# Altium project UZ_D_Testboard.PrjPcb
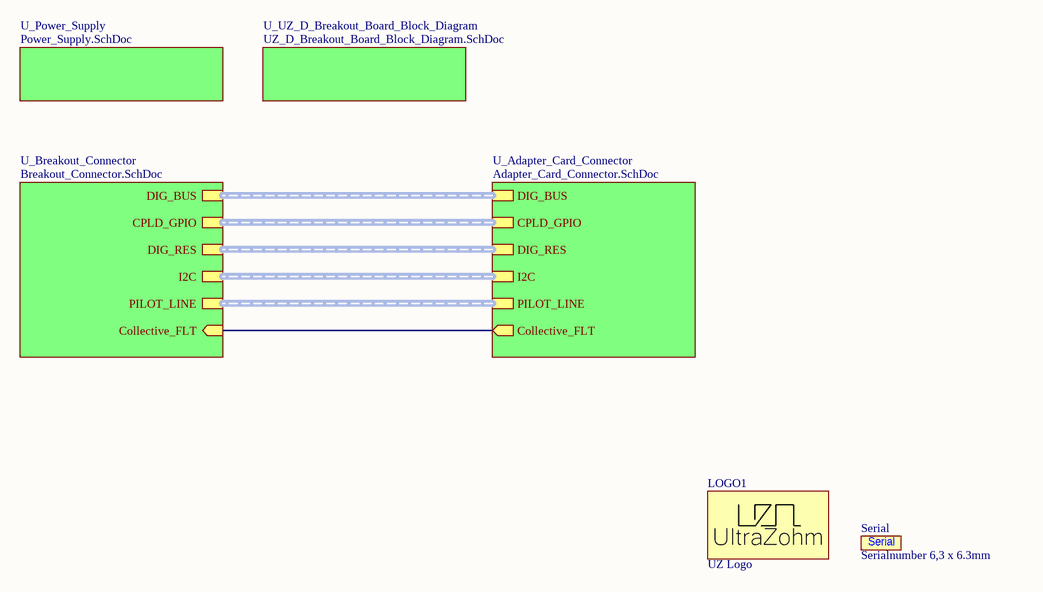
[diagram p0: Topsheet.SchDoc]
AuthorParam: Andreas Geiger; ProjectDate: 04/2021; ProjectRevision: Rev01
5 sheets, 51 parts. Net scope: hierarchical (ports join the sheet entries above them; power ports are global).
Board file: UZ_D_Testboard.PcbDoc
Sheets:
  Topsheet.SchDoc
    U_Adapter_Card_Connector = Adapter_Card_Connector.SchDoc
    U_Breakout_Connector = Breakout_Connector.SchDoc
    U_Power_Supply = Power_Supply.SchDoc
    U_UZ_D_Breakout_Board_Block_Diagram = UZ_D_Breakout_Board_Block_Diagram.SchDoc

## Sheet Topsheet.SchDoc
size A4; PageSetup: Record=PageOptions|CenterHorizontal=True|CenterVertical=True|PrintScale=0.92|XCorrection=1.00|YCorrection=1.00|PrintKind=0|BorderSize=5000000|LeftOffset=0|BottomOffset=0|Orientation=2|PaperLength=1000|PaperWidth=1000|Scale=100|PaperSource=7|PrintQuality=-4|MediaType=1|DitherType=10|PrintScaleMode=1|PaperKind=A4; Author: Andreas Geiger; CompanyName: Technische Hochschule Nürnberg Georg Simon Ohm; Organization: UltraZohm; Address1: Kesslerplatz 12; Address2: 90489 Nürnberg; Address3: GERMANY; DocumentNumber: 5; SheetNumber: 5; SheetTotal: 5; Website: www.ultrazohm.com

### Parts
LOGO1  UZ Logo  [UZ_Logo_small]  (no BOM)
Serial  Serialnumber 6,3 x 6.3mm  [Serial_6.3x6.3mm]  (no BOM)

### Sub-sheets
U_Adapter_Card_Connector = Adapter_Card_Connector.SchDoc: DIG_BUS (harness DIG_BUS), CPLD_GPIO (harness CPLD_GPIO), DIG_RES (harness DIG_RES), I2C (harness I2C), PILOT_LINE (harness PILOT_LINE), Collective_FLT (out)
U_Breakout_Connector = Breakout_Connector.SchDoc: DIG_BUS (harness DIG_BUS), CPLD_GPIO (harness CPLD_GPIO), DIG_RES (harness DIG_RES), I2C (harness I2C), PILOT_LINE (harness PILOT_LINE), Collective_FLT (in)
U_Power_Supply = Power_Supply.SchDoc: no entries
U_UZ_D_Breakout_Board_Block_Diagram = UZ_D_Breakout_Board_Block_Diagram.SchDoc: no entries

### Nets
Collective_FLT: sheet U_Adapter_Card_Connector/Collective_FLT, sheet U_Breakout_Connector/Collective_FLT

### Buses and harness runs
harness sheet U_Adapter_Card_Connector/CPLD_GPIO = sheet U_Breakout_Connector/CPLD_GPIO
harness sheet U_Adapter_Card_Connector/DIG_BUS = sheet U_Breakout_Connector/DIG_BUS
harness sheet U_Adapter_Card_Connector/DIG_RES = sheet U_Breakout_Connector/DIG_RES
harness sheet U_Adapter_Card_Connector/I2C = sheet U_Breakout_Connector/I2C
harness sheet U_Adapter_Card_Connector/PILOT_LINE = sheet U_Breakout_Connector/PILOT_LINE

### Notes on the sheet
- Title
- Revision:
- Design Engineer:
- Date:
- Project:
- Sheet
- of

### Library data of the parts
LOGO1 = UZ Logo: UltraZohm Logo on PCB; Created: Jan2021_Liegmann; Value: UZ Logo
Serial = SerialNumber: Created: 2018_09_18_AGeiger; Value: Serialnumber 6,3 x 6.3mm

## Sheet Adapter_Card_Connector.SchDoc
size A4; PageSetup: Record=PageOptions|CenterHorizontal=True|CenterVertical=True|PrintScale=0.92|XCorrection=1.00|YCorrection=1.00|PrintKind=0|BorderSize=5000000|LeftOffset=0|BottomOffset=0|Orientation=2|PaperLength=1000|PaperWidth=1000|Scale=100|PaperSource=7|PrintQuality=-4|MediaType=1|DitherType=10|PrintScaleMode=1|PaperKind=A4; Author: Andreas Geiger; CompanyName: Technische Hochschule Nürnberg Georg Simon Ohm; Organization: UltraZohm; Address1: Kesslerplatz 12; Address2: 90489 Nürnberg; Address3: GERMANY; DocumentNumber: 2; SheetNumber: 2; SheetTotal: 5; Website: www.ultrazohm.com
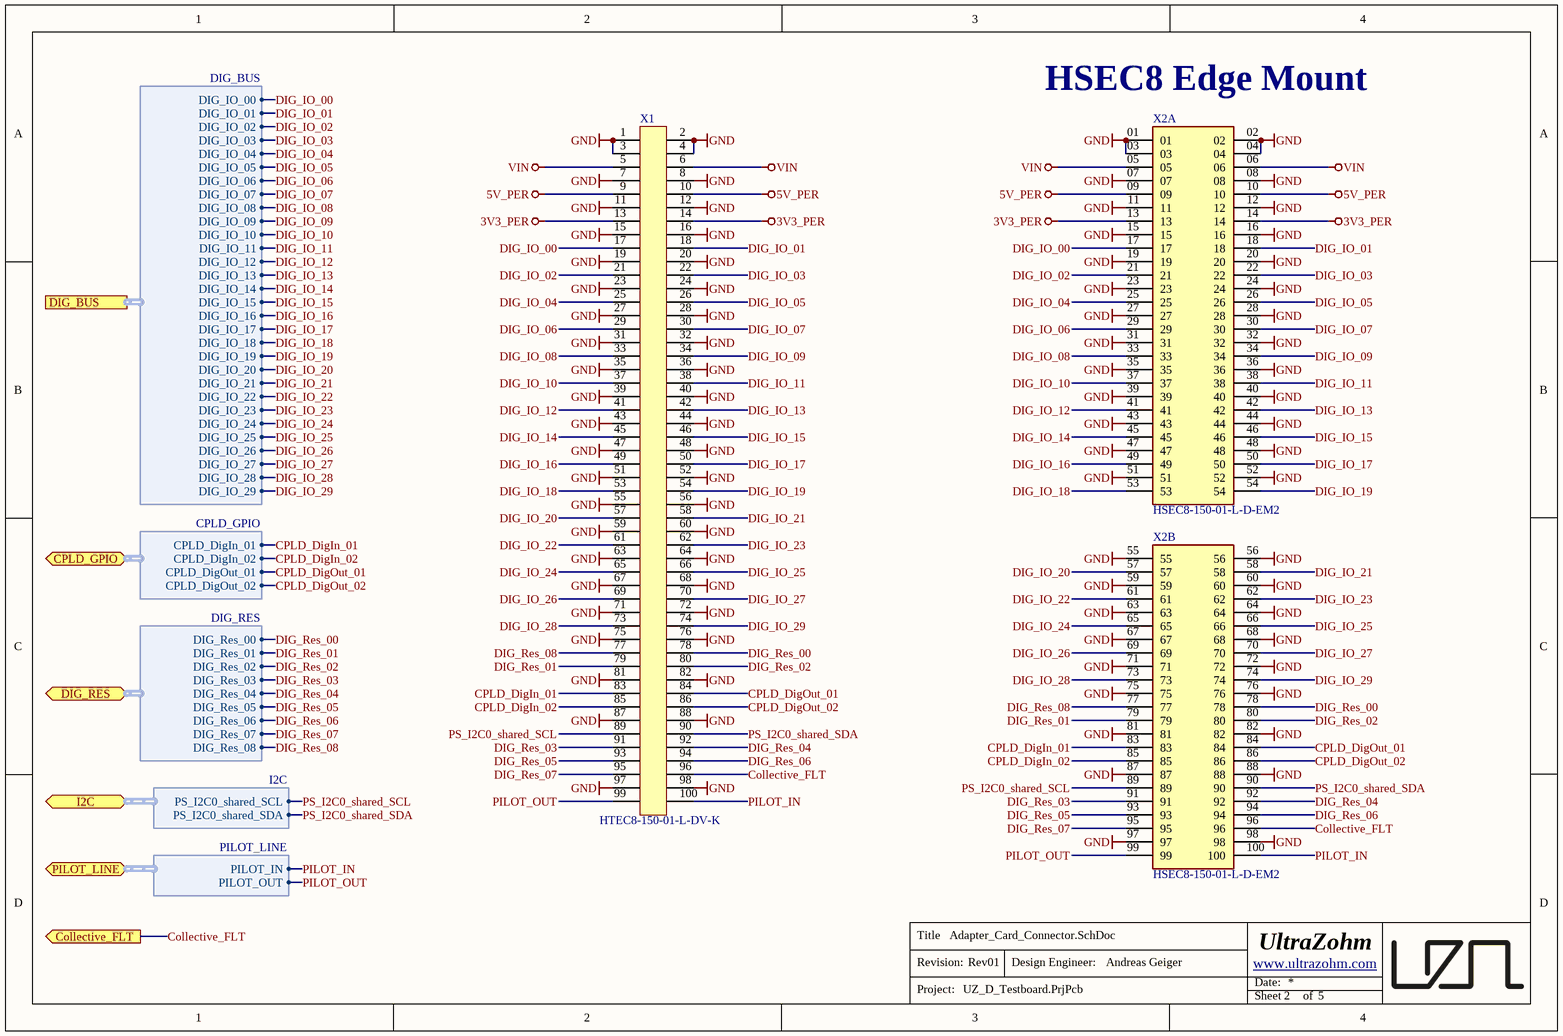
[diagram p1: Adapter_Card_Connector.SchDoc]

### Parts
X1  HTEC8-150-01-L-DV-K  [HTEC8-150-XX-X-DV]
X2  HSEC8-150-01-L-D-EM2  [HSEC8-150-01-L-D-EM2]  (parts A,B of 2)

### Ports
Collective_FLT (out), CPLD_GPIO (bidir, harness CPLD_GPIO), DIG_BUS (harness DIG_BUS), DIG_RES (bidir, harness DIG_RES), I2C (bidir, harness I2C), PILOT_LINE (bidir, harness PILOT_LINE)

### Harnesses
DIG_BUS: DIG_IO_01, DIG_IO_02, DIG_IO_03, DIG_IO_04, DIG_IO_05, DIG_IO_06, DIG_IO_07, DIG_IO_08, DIG_IO_09, DIG_IO_10, DIG_IO_11, DIG_IO_12, DIG_IO_13, DIG_IO_14, DIG_IO_15, DIG_IO_16, DIG_IO_17, DIG_IO_18, DIG_IO_19, DIG_IO_20, DIG_IO_21, DIG_IO_22, DIG_IO_23, DIG_IO_24, DIG_IO_25, DIG_IO_26, DIG_IO_27, DIG_IO_28, DIG_IO_29, DIG_IO_00
CPLD_GPIO: CPLD_DigIn_01, CPLD_DigOut_01, CPLD_DigIn_02, CPLD_DigOut_02
DIG_RES: DIG_Res_00, DIG_Res_08, DIG_Res_01, DIG_Res_02, DIG_Res_03, DIG_Res_04, DIG_Res_05, DIG_Res_06, DIG_Res_07
I2C: PS_I2C0_shared_SDA, PS_I2C0_shared_SCL
PILOT_LINE: PILOT_OUT, PILOT_IN

### Nets
3V3_PER: X1.13 X1.14 X2.13 X2.14
5V_PER: X1.9 X1.10 X2.09 X2.10
GND: X1.1 X1.2 X1.3 X1.4 X1.7 X1.8 X1.11 X1.12 X1.15 X1.16 X1.19 X1.20 X1.23 X1.24 X1.27 X1.28 X1.31 X1.32 X1.35 X1.36 X1.39 X1.40 X1.43 X1.44 X1.47 X1.48 X1.51 X1.52 X1.55 X1.56 X1.59 X1.60 X1.63 X1.64 X1.67 X1.68 X1.71 X1.72 X1.75 X1.76 X1.81 X1.82 X1.87 X1.88 X1.97 X1.98 X2.01 X2.02 X2.03 X2.04 X2.07 X2.08 X2.11 X2.12 X2.15 X2.16 X2.19 X2.20 X2.23 X2.24 X2.27 X2.28 X2.31 X2.32 X2.35 X2.36 X2.39 X2.40 X2.43 X2.44 X2.47 X2.48 X2.51 X2.52 X2.55 X2.56 X2.59 X2.60 X2.63 X2.64 X2.67 X2.68 X2.71 X2.72 X2.75 X2.76 X2.81 X2.82 X2.87 X2.88 X2.97 X2.98
VIN: X1.5 X1.6 X2.05 X2.06
Collective_FLT: X1.96 X2.96 ; port Collective_FLT
CPLD_DigIn_01: X1.83 X2.83 ; port CPLD_GPIO.CPLD_DigIn_01
CPLD_DigIn_02: X1.85 X2.85 ; port CPLD_GPIO.CPLD_DigIn_02
CPLD_DigOut_01: X1.84 X2.84 ; port CPLD_GPIO.CPLD_DigOut_01
CPLD_DigOut_02: X1.86 X2.86 ; port CPLD_GPIO.CPLD_DigOut_02
DIG_IO_00: X1.17 X2.17 ; port DIG_BUS.DIG_IO_00
DIG_IO_01: X1.18 X2.18 ; port DIG_BUS.DIG_IO_01
DIG_IO_02: X1.21 X2.21 ; port DIG_BUS.DIG_IO_02
DIG_IO_03: X1.22 X2.22 ; port DIG_BUS.DIG_IO_03
DIG_IO_04: X1.25 X2.25 ; port DIG_BUS.DIG_IO_04
DIG_IO_05: X1.26 X2.26 ; port DIG_BUS.DIG_IO_05
DIG_IO_06: X1.29 X2.29 ; port DIG_BUS.DIG_IO_06
DIG_IO_07: X1.30 X2.30 ; port DIG_BUS.DIG_IO_07
DIG_IO_08: X1.33 X2.33 ; port DIG_BUS.DIG_IO_08
DIG_IO_09: X1.34 X2.34 ; port DIG_BUS.DIG_IO_09
DIG_IO_10: X1.37 X2.37 ; port DIG_BUS.DIG_IO_10
DIG_IO_11: X1.38 X2.38 ; port DIG_BUS.DIG_IO_11
DIG_IO_12: X1.41 X2.41 ; port DIG_BUS.DIG_IO_12
DIG_IO_13: X1.42 X2.42 ; port DIG_BUS.DIG_IO_13
DIG_IO_14: X1.45 X2.45 ; port DIG_BUS.DIG_IO_14
DIG_IO_15: X1.46 X2.46 ; port DIG_BUS.DIG_IO_15
DIG_IO_16: X1.49 X2.49 ; port DIG_BUS.DIG_IO_16
DIG_IO_17: X1.50 X2.50 ; port DIG_BUS.DIG_IO_17
DIG_IO_18: X1.53 X2.53 ; port DIG_BUS.DIG_IO_18
DIG_IO_19: X1.54 X2.54 ; port DIG_BUS.DIG_IO_19
DIG_IO_20: X1.57 X2.57 ; port DIG_BUS.DIG_IO_20
DIG_IO_21: X1.58 X2.58 ; port DIG_BUS.DIG_IO_21
DIG_IO_22: X1.61 X2.61 ; port DIG_BUS.DIG_IO_22
DIG_IO_23: X1.62 X2.62 ; port DIG_BUS.DIG_IO_23
DIG_IO_24: X1.65 X2.65 ; port DIG_BUS.DIG_IO_24
DIG_IO_25: X1.66 X2.66 ; port DIG_BUS.DIG_IO_25
DIG_IO_26: X1.69 X2.69 ; port DIG_BUS.DIG_IO_26
DIG_IO_27: X1.70 X2.70 ; port DIG_BUS.DIG_IO_27
DIG_IO_28: X1.73 X2.73 ; port DIG_BUS.DIG_IO_28
DIG_IO_29: X1.74 X2.74 ; port DIG_BUS.DIG_IO_29
DIG_Res_00: X1.78 X2.78 ; port DIG_RES.DIG_Res_00
DIG_Res_01: X1.79 X2.79 ; port DIG_RES.DIG_Res_01
DIG_Res_02: X1.80 X2.80 ; port DIG_RES.DIG_Res_02
DIG_Res_03: X1.91 X2.91 ; port DIG_RES.DIG_Res_03
DIG_Res_04: X1.92 X2.92 ; port DIG_RES.DIG_Res_04
DIG_Res_05: X1.93 X2.93 ; port DIG_RES.DIG_Res_05
DIG_Res_06: X1.94 X2.94 ; port DIG_RES.DIG_Res_06
DIG_Res_07: X1.95 X2.95 ; port DIG_RES.DIG_Res_07
DIG_Res_08: X1.77 X2.77 ; port DIG_RES.DIG_Res_08
PILOT_IN: X1.100 X2.100 ; port PILOT_LINE.PILOT_IN
PILOT_OUT: X1.99 X2.99 ; port PILOT_LINE.PILOT_OUT
PS_I2C0_shared_SCL: X1.89 X2.89 ; port I2C.PS_I2C0_shared_SCL
PS_I2C0_shared_SDA: X1.90 X2.90 ; port I2C.PS_I2C0_shared_SDA

### Notes on the sheet
- (near X2) HSEC8 Edge Mount
- Title
- Revision:
- Design Engineer:
- Date:
- Project:
- Sheet
- of

### Library data of the parts
X1 = 30757: AN: 30757; Mixed: SMT; Temperature-Range: -55/+125; Extra: Samtec 0.80 mm High-Speed Edge Card Connector, 100pin 10µ Plating; Case: HTEC8; HelpURL: b:\AD\adlib\datasheet\Samtec\HTEC8\; H-ART: HTEC8-150-01-L-DV-K
X2 = HSEC8-150-01-L-D-EM2: 100 Position Female Connector Non Specified - Dual Edge Gold 0.031" (0.80mm) Black; MF: Samtec; Value: HSEC8-150-01-L-D-EM2; MPN: HSEC8-150-01-L-D-EM2; Created: 2021_03_24_AGeiger

## Sheet Breakout_Connector.SchDoc
size A4; PageSetup: Record=PageOptions|CenterHorizontal=True|CenterVertical=True|PrintScale=0.92|XCorrection=1.00|YCorrection=1.00|PrintKind=0|BorderSize=5000000|LeftOffset=0|BottomOffset=0|Orientation=2|PaperLength=1000|PaperWidth=1000|Scale=100|PaperSource=7|PrintQuality=-4|MediaType=1|DitherType=10|PrintScaleMode=1|PaperKind=A4; Author: Andreas Geiger; CompanyName: Technische Hochschule Nürnberg Georg Simon Ohm; Organization: UltraZohm; Address1: Kesslerplatz 12; Address2: 90489 Nürnberg; Address3: GERMANY; DocumentNumber: 3; SheetNumber: 3; SheetTotal: 5; Website: www.ultrazohm.com
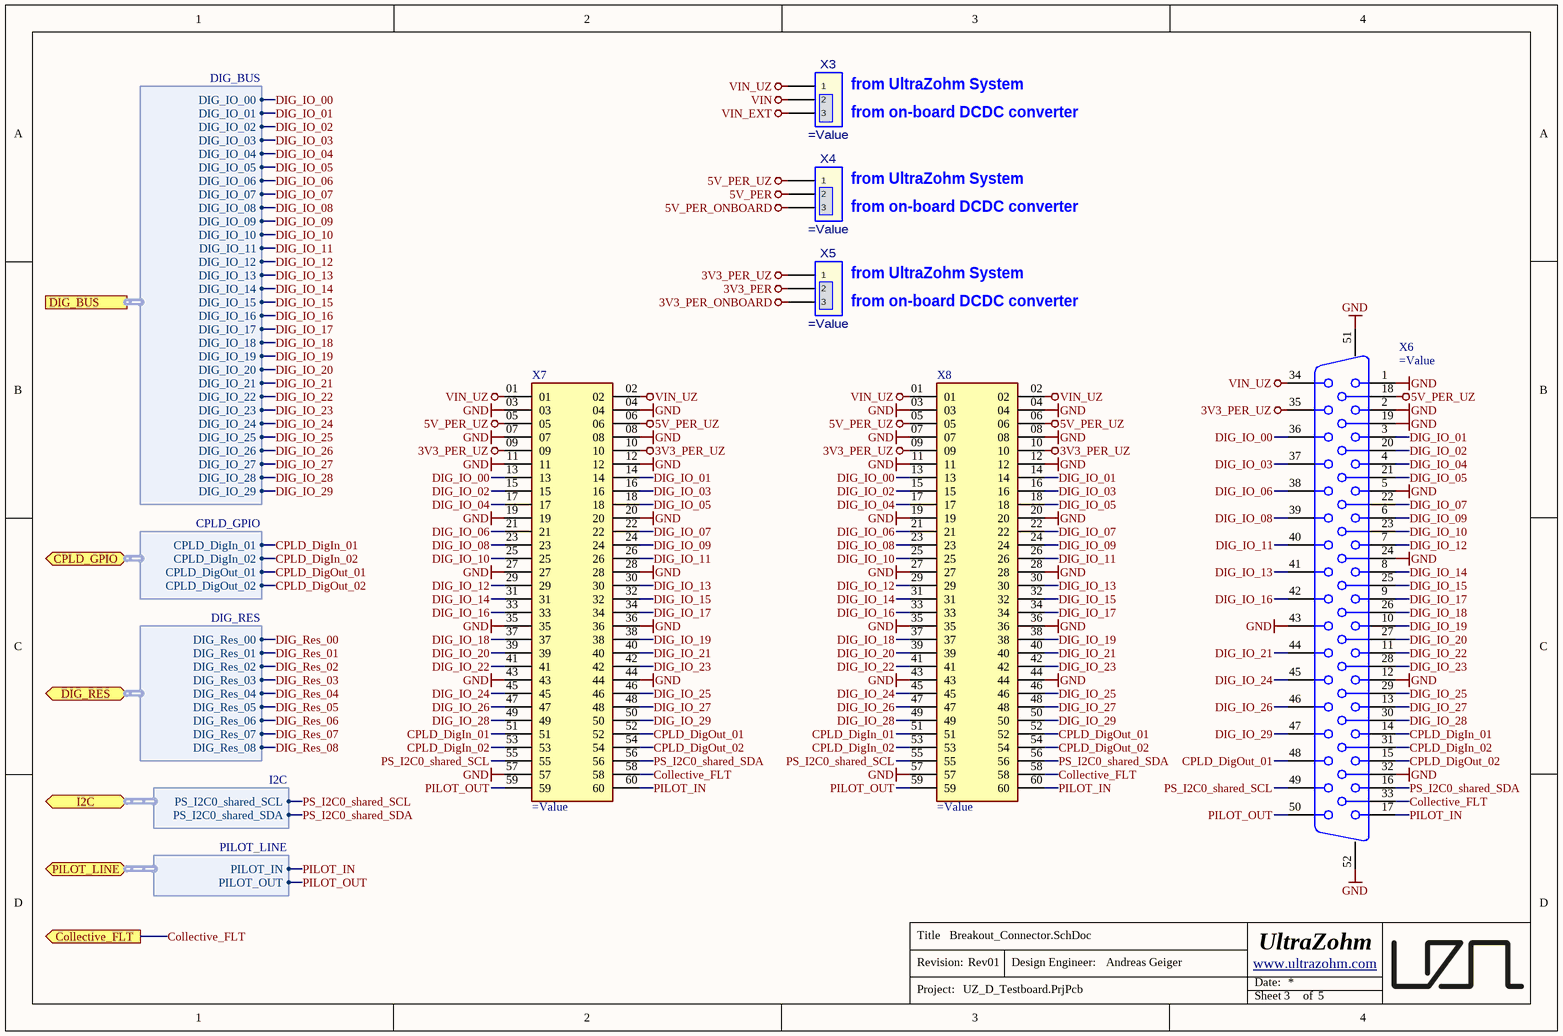
[diagram p2: Breakout_Connector.SchDoc]

### Parts
X3  (no value)  [TSW-103-XX-XXX-S]
X4  (no value)  [TSW-103-XX-XXX-S]
X5  (no value)  [TSW-103-XX-XXX-S]
X6  (no value)  [dsub50_male_163A18339X]
X7  (no value)  [TSM-130-01-F-DV]
X8  (no value)  [HTSS-130-01-L-DV]

### Ports
Collective_FLT (out), CPLD_GPIO (bidir, harness CPLD_GPIO), DIG_BUS (harness DIG_BUS), DIG_RES (bidir, harness DIG_RES), I2C (bidir, harness I2C), PILOT_LINE (bidir, harness PILOT_LINE)

### Harnesses
DIG_BUS: DIG_IO_01, DIG_IO_02, DIG_IO_03, DIG_IO_04, DIG_IO_05, DIG_IO_06, DIG_IO_07, DIG_IO_08, DIG_IO_09, DIG_IO_10, DIG_IO_11, DIG_IO_12, DIG_IO_13, DIG_IO_14, DIG_IO_15, DIG_IO_16, DIG_IO_17, DIG_IO_18, DIG_IO_19, DIG_IO_20, DIG_IO_21, DIG_IO_22, DIG_IO_23, DIG_IO_24, DIG_IO_25, DIG_IO_26, DIG_IO_27, DIG_IO_28, DIG_IO_29, DIG_IO_00
CPLD_GPIO: CPLD_DigIn_01, CPLD_DigOut_01, CPLD_DigIn_02, CPLD_DigOut_02
DIG_RES: DIG_Res_00, DIG_Res_08, DIG_Res_01, DIG_Res_02, DIG_Res_03, DIG_Res_04, DIG_Res_05, DIG_Res_06, DIG_Res_07
I2C: PS_I2C0_shared_SDA, PS_I2C0_shared_SCL
PILOT_LINE: PILOT_OUT, PILOT_IN

### Nets
3V3_PER: X5.2
3V3_PER_ONBOARD: X5.3
3V3_PER_UZ: X5.1 X6.35 X7.09 X7.10 X8.09 X8.10
5V_PER: X4.2
5V_PER_ONBOARD: X4.3
5V_PER_UZ: X4.1 X6.18 X7.05 X7.06 X8.05 X8.06
GND: X6.1 X6.2 X6.5 X6.12 X6.19 X6.24 X6.32 X6.43 X6.51 X6.52 X7.03 X7.04 X7.07 X7.08 X7.11 X7.12 X7.19 X7.20 X7.27 X7.28 X7.35 X7.36 X7.43 X7.44 X7.57 X8.03 X8.04 X8.07 X8.08 X8.11 X8.12 X8.19 X8.20 X8.27 X8.28 X8.35 X8.36 X8.43 X8.44 X8.57
VIN: X3.2
VIN_EXT: X3.3
VIN_UZ: X3.1 X6.34 X7.01 X7.02 X8.01 X8.02
Collective_FLT: X6.33 X7.58 X8.58 ; port Collective_FLT
CPLD_DigIn_01: X6.14 X7.51 X8.51 ; port CPLD_GPIO.CPLD_DigIn_01
CPLD_DigIn_02: X6.31 X7.53 X8.53 ; port CPLD_GPIO.CPLD_DigIn_02
CPLD_DigOut_01: X6.48 X7.52 X8.52 ; port CPLD_GPIO.CPLD_DigOut_01
CPLD_DigOut_02: X6.15 X7.54 X8.54 ; port CPLD_GPIO.CPLD_DigOut_02
DIG_IO_00: X6.36 X7.13 X8.13 ; port DIG_BUS.DIG_IO_00
DIG_IO_01: X6.3 X7.14 X8.14 ; port DIG_BUS.DIG_IO_01
DIG_IO_02: X6.20 X7.15 X8.15 ; port DIG_BUS.DIG_IO_02
DIG_IO_03: X6.37 X7.16 X8.16 ; port DIG_BUS.DIG_IO_03
DIG_IO_04: X6.4 X7.17 X8.17 ; port DIG_BUS.DIG_IO_04
DIG_IO_05: X6.21 X7.18 X8.18 ; port DIG_BUS.DIG_IO_05
DIG_IO_06: X6.38 X7.21 X8.21 ; port DIG_BUS.DIG_IO_06
DIG_IO_07: X6.22 X7.22 X8.22 ; port DIG_BUS.DIG_IO_07
DIG_IO_08: X6.39 X7.23 X8.23 ; port DIG_BUS.DIG_IO_08
DIG_IO_09: X6.6 X7.24 X8.24 ; port DIG_BUS.DIG_IO_09
DIG_IO_10: X6.23 X7.25 X8.25 ; port DIG_BUS.DIG_IO_10
DIG_IO_11: X6.40 X7.26 X8.26 ; port DIG_BUS.DIG_IO_11
DIG_IO_12: X6.7 X7.29 X8.29 ; port DIG_BUS.DIG_IO_12
DIG_IO_13: X6.41 X7.30 X8.30 ; port DIG_BUS.DIG_IO_13
DIG_IO_14: X6.8 X7.31 X8.31 ; port DIG_BUS.DIG_IO_14
DIG_IO_15: X6.25 X7.32 X8.32 ; port DIG_BUS.DIG_IO_15
DIG_IO_16: X6.42 X7.33 X8.33 ; port DIG_BUS.DIG_IO_16
DIG_IO_17: X6.9 X7.34 X8.34 ; port DIG_BUS.DIG_IO_17
DIG_IO_18: X6.26 X7.37 X8.37 ; port DIG_BUS.DIG_IO_18
DIG_IO_19: X6.10 X7.38 X8.38 ; port DIG_BUS.DIG_IO_19
DIG_IO_20: X6.27 X7.39 X8.39 ; port DIG_BUS.DIG_IO_20
DIG_IO_21: X6.44 X7.40 X8.40 ; port DIG_BUS.DIG_IO_21
DIG_IO_22: X6.11 X7.41 X8.41 ; port DIG_BUS.DIG_IO_22
DIG_IO_23: X6.28 X7.42 X8.42 ; port DIG_BUS.DIG_IO_23
DIG_IO_24: X6.45 X7.45 X8.45 ; port DIG_BUS.DIG_IO_24
DIG_IO_25: X6.29 X7.46 X8.46 ; port DIG_BUS.DIG_IO_25
DIG_IO_26: X6.46 X7.47 X8.47 ; port DIG_BUS.DIG_IO_26
DIG_IO_27: X6.13 X7.48 X8.48 ; port DIG_BUS.DIG_IO_27
DIG_IO_28: X6.30 X7.49 X8.49 ; port DIG_BUS.DIG_IO_28
DIG_IO_29: X6.47 X7.50 X8.50 ; port DIG_BUS.DIG_IO_29
PILOT_IN: X6.17 X7.60 X8.60 ; port PILOT_LINE.PILOT_IN
PILOT_OUT: X6.50 X7.59 X8.59 ; port PILOT_LINE.PILOT_OUT
PS_I2C0_shared_SCL: X6.49 X7.55 X8.55 ; port I2C.PS_I2C0_shared_SCL
PS_I2C0_shared_SDA: X6.16 X7.56 X8.56 ; port I2C.PS_I2C0_shared_SDA

### Notes on the sheet
- (near X3) from UltraZohm System
- (near X3) from on-board DCDC converter
- (near X4) from UltraZohm System
- (near X4) from on-board DCDC converter
- (near X5) from UltraZohm System
- (near X5) from on-board DCDC converter
- Title
- Revision:
- Design Engineer:
- Date:
- Project:
- Sheet
- of

### Library data of the parts
X3-X5 = TSW-103-XX-XXX-S: .025[0.64] SQ. POST TERMINAL STRIP ASSEMBLY.; Manufacturer: SAMTEC; MPN: TSW-103-07-F-S; Value: TSW-103-07-F-S; Created: 2020_11_26_AGeiger
X6 = DSUB50_male: D-SUB, male, right angle, 50pos, 9.4mm pitch; MPN: 163A18339X; MF: CONEC; Value: 163A18339X; Supplier Part Number 1: D-SUB ST 50GWC; Supplier 1: Reichelt; Supplier 2: Mouser; Supplier 3: Digi-Key; Created: 2021_03_25_AGeiger
X7 = TSM-130-01-F-DV: MF: Samtec; MPN: TSM-130-01-F-DV; Value: TSM-130-01-F-DV; Created: 2021_03_23_AGeiger
X8 = HTSS-130-01-L-DV: MF: SAMTEC; Value: HTSS-130-01-L-DV; MPN: HTSS-130-01-L-DV

## Sheet Power_Supply.SchDoc
size A4; PageSetup: Record=PageOptions|CenterHorizontal=True|CenterVertical=True|PrintScale=0.92|XCorrection=1.00|YCorrection=1.00|PrintKind=0|BorderSize=5000000|LeftOffset=0|BottomOffset=0|Orientation=2|PaperLength=1000|PaperWidth=1000|Scale=100|PaperSource=7|PrintQuality=-4|MediaType=1|DitherType=10|PrintScaleMode=1|PaperKind=A4; Author: Andreas Geiger; CompanyName: Technische Hochschule Nürnberg Georg Simon Ohm; Organization: UltraZohm; Address1: Kesslerplatz 12; Address2: 90489 Nürnberg; Address3: GERMANY; DocumentNumber: 4; SheetNumber: 4; SheetTotal: 5; Website: www.ultrazohm.com
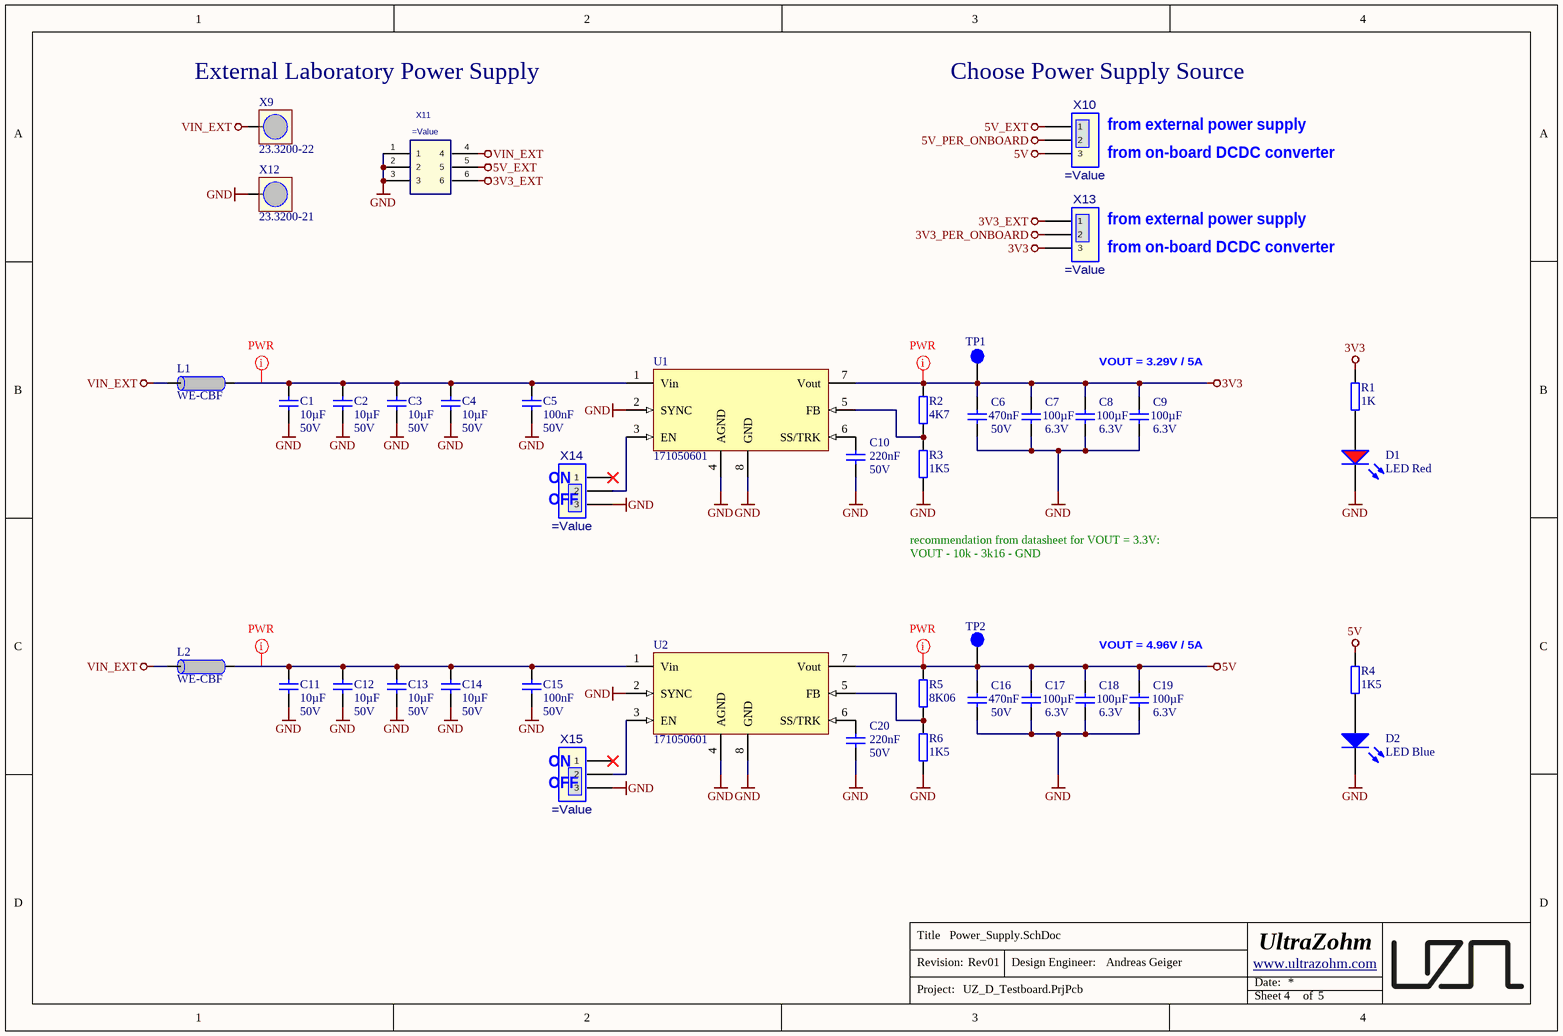
[diagram p3: Power_Supply.SchDoc]

### Parts
C1  10µF  Voltage: 50V  [CAPC3216X180N_V]
C2  10µF  Voltage: 50V  [CAPC3216X180N_V]
C3  10µF  Voltage: 50V  [CAPC3216X180N_V]
C4  10µF  Voltage: 50V  [CAPC3216X180N_V]
C5  100nF  Voltage: 50V  [CAPC1608X90N_V]
C6  470nF  Voltage: 50V  [CAPC1608X90N_V]
C7  100µF  Voltage: 6.3V  [CAPC3216X180N_V]
C8  100µF  Voltage: 6.3V  [CAPC3216X180N_V]
C9  100µF  Voltage: 6.3V  [CAPC3216X180N_V]
C10  220nF  Voltage: 50V  [CAPC1608X90N_V]
C11  10µF  Voltage: 50V  [CAPC3216X180N_V]
C12  10µF  Voltage: 50V  [CAPC3216X180N_V]
C13  10µF  Voltage: 50V  [CAPC3216X180N_V]
C14  10µF  Voltage: 50V  [CAPC3216X180N_V]
C15  100nF  Voltage: 50V  [CAPC1608X90N_V]
C16  470nF  Voltage: 50V  [CAPC1608X90N_V]
C17  100µF  Voltage: 6.3V  [CAPC3216X180N_V]
C18  100µF  Voltage: 6.3V  [CAPC3216X180N_V]
C19  100µF  Voltage: 6.3V  [CAPC3216X180N_V]
C20  220nF  Voltage: 50V  [CAPC1608X90N_V]
D1  LED Red  [WL-SMCW_0603]
D2  LED Blue  [WL-SMCW_0603]
L1  WE-CBF  [INDC2012X92N_V]
L2  WE-CBF  [INDC2012X92N_V]
R1  1K  [RESC1608X55N_V]
R2  4K7  [RESC1608X55N_V]
R3  1K5  [RESC1608X55N_V]
R4  1K5  [RESC1608X55N_V]
R5  8K06  [RESC1608X55N_V]
R6  1K5  [RESC1608X55N_V]
TP1  Testpoint 1mm  [TP_1mm]  (value not drawn)
TP2  Testpoint 1mm  [TP_1mm]  (value not drawn)
U1  171050601  [7TO-PMOD]
U2  171050601  [7TO-PMOD]
X9  23.3200-22  [Bannanenbuchse Rot Stäubli 23.3200-22]
X10  (no value)  [TSW-103-XX-XXX-S]
X11  (no value)  [IPL1-103-01-L-D-RA-K]
X12  23.3200-21  [Bannanenbuchse Schwarz Stäubli 23.3200-21]
X13  (no value)  [TSW-103-XX-XXX-S]
X14  (no value)  [TSW-103-XX-XXX-S]
X15  (no value)  [TSW-103-XX-XXX-S]

### Nets
3V3: C6.1 C7.1 C8.1 C9.1 R1.2 R2.2 TP1.1 U1.7(Vout) X13.3
3V3_EXT: X11.6 X13.1
3V3_PER_ONBOARD: X13.2
5V: C16.1 C17.1 C18.1 C19.1 R4.2 R5.2 TP2.1 U2.7(Vout) X10.3
5V_EXT: X10.1 X11.5
5V_PER_ONBOARD: X10.2
GND: C1.2 C2.2 C3.2 C4.2 C5.1 C6.2 C7.2 C8.2 C9.2 C10.2 C11.2 C12.2 C13.2 C14.2 C15.1 C16.2 C17.2 C18.2 C19.2 C20.2 D1.1(K) D2.1(K) R3.1 R6.2 U1.2(SYNC) U1.4(AGND) U1.8(GND) U2.2(SYNC) U2.4(AGND) U2.8(GND) X11.1 X11.2 X11.3 X12.1 X14.3 X15.3
VIN_EXT: L1.2 L2.2 X9.1 X11.4
NetC1_1: C1.1 C2.1 C3.1 C4.1 C5.2 L1.1 U1.1(Vin)
NetC10_1: C10.1 U1.6(SS/TRK)
NetC11_1: C11.1 C12.1 C13.1 C14.1 C15.2 L2.1 U2.1(Vin)
NetC20_1: C20.1 U2.6(SS/TRK)
NetD1_2: D1.2(A) R1.1
NetD2_2: D2.2(A) R4.1
NetR2_1: R2.1 R3.2 U1.5(FB)
NetR5_1: R5.1 R6.1 U2.5(FB)
NetU1_3: U1.3(EN) X14.2
NetU2_3: U2.3(EN) X15.2

Not connected (* = marked no-connect by the designer): X14 1*; X15 1*

### Layout directives
net class PWR: 3V3, 5V, NetC1_1, NetC11_1

### Notes on the sheet
- (near X9) External Laboratory Power Supply
- (near X10) Choose Power Supply Source
- (near X10) from external power supply
- (near X10) from on-board DCDC converter
- (near X13) from external power supply
- (near X13) from on-board DCDC converter
- VOUT = 3.29V / 5A
- ON
- (near X14) OFF
- recommendation from datasheet for VOUT = 3.3V:
  VOUT - 10k - 3k16 - GND
- VOUT = 4.96V / 5A
- (near X15) OFF
- Title
- Revision:
- Design Engineer:
- Date:
- Project:
- Sheet
- of

### Library data of the parts
C1-C4 C11-C14 = 24685: KON 10µF 50V X5R 10%  SMD BF 3216 (1206); Value: 10u; AN: 24685; Mixed: SMT; Temperature-Range: -55/+85; Preferred: Yes; Technology: X5R; Case: 3216 (1206); Tolerance: 10%
C5 C15 = 21382: KON 100nF 50V X7R ±10% SMD BF 1608 (0603); Value: 100n; AN: 21382; Mixed: SMT; Preferred: Yes; Temperature-Range: -55/+125; Tolerance: ±10%; Technology: X7R; Case: 1608 (0603)
C6 C16 = 25476: KON 470nF 50V X7R SMD  BF 1608 (0603); Value: 470n; AN: 25476; Mixed: SMT; Preferred: Yes; Temperature-Range: -55/+125; Technology: X7R; Case: 1608 (0603)
C7-C9 C17-C19 = 23116: KON 100µF 6,3V X5R 20% SMD BF 3216 (1206); AN: 23116; Mixed: SMT; Value: 100u; Preferred: Yes; Temperature-Range: -55/+85; Technology: X5R; Case: 3216 (1206); Tolerance: 20%
C10 C20 = 29694: KON 220nF 50V X7R ±10% SMD BF 1608 (0603); Value: 220n; AN: 29694; Mixed: SMT; Temperature-Range: -55/+125; Tolerance: ±10%; Technology: X7R; Case: 1608 (0603)
D1 = KT-0603R: LED RED 520~625NM 90~100MCD@20MA TOP VIEW 0603 ROHS; Manufacturer: Hubei KENTO Elec; Type: Standard; Created from: T. Wendt; Forward Current I_f: 20 mA; Forward Voltage U_f: 2.1 V; Wavelength: 620 nm; Light Intensity: 110 mcd; Nominal Power: 42 mW; Manufacturer Part Number: KT-0603R; PartID: 8; Created On: 03.03.2021 10:06:23; ComponentLink1Description: Datasheet; ComponentLink1URL: https://datasheet.lcsc.com/szlcsc/Hubei-KENTO-Elec-KT-0603R_C2286.pdf; Component Type: LED Diode; Device Package: 0603; Last Updated: 04.03.2021 09:02:49; Mounting Type: SMD; Operating Temperature: -40 - 85 °C; Supplier 1: LCSC; Supplier Part Number 1: C2286; Live Cycle Status: 1; Stock number: not stored; Color: red; LCSC Part Number: C2286
D2 = 19-217/BHC-ZL1M2RY/3T: LED BLUE 465~475NM 11.5~28.5MCD@5MA TOP VIEW 0603 ROHS; Manufacturer: Everlight Elec; Type: Standard; Created from: T. Wendt; Forward Current I_f: 20 mA; Forward Voltage U_f: 2.8 V; Wavelength: 470 nm; Nominal Power: 68 mW; Manufacturer Part Number: 19-217/BHC-ZL1M2RY/3T; PartID: 6; Created On: 03.03.2021 09:59:51; ComponentLink1Description: Datasheet; ComponentLink1URL: https://datasheet.lcsc.com/szlcsc/Everlight-Elec-19-217-BHC-ZL1M2RY-3T_C72041.pdf; Component Type: LED Diode; Device Package: 0603; Last Updated: 04.03.2021 09:02:49; Mounting Type: SMD; Operating Temperature: -40 - 85 °C; Supplier 1: LCSC; Supplier Part Number 1: C72041; Live Cycle Status: 1; Stock number: not stored; Color: blue; Light Intensity: 28.5 mcd; LCSC Part Number: C72041
L1 L2 = 24513: Ferritdurchführung SMD 0805; AN: 24513; Voltage: 2000mA; Mixed: SMT; Trenz-Stock: Yes; H-ART: 742792040; Extra: 0,15 Ohm DC, 600 Ohm bei 100MHz, 700 Ohm bei 150Mhz, 2000mA; Case: 2012 (0805); Technology: 0.15Ohm; HelpURL: B:\AD\adlib\datasheet\742792040
R1 = 21375: WID SMD 1K 1% 0,1W; AN: 21375; Mixed: SMT; Preferred: Yes; Extra: BF 1608 (0603); Value: 1K; Tolerance: 1%; Case: 1608 (0603); Technology: TK100
R2 = 21378: WID SMD 4K7 1% 0,1W BF 1608 (0603); Value: 4.7K; AN: 21378; Mixed: SMT; Preferred: Yes; Tolerance: 1%; Case: 1608 (0603); Technology: TK100
R3 R4 = 21514: WID SMD 1K5 1% 0,1W; Value: 1.5K; AN: 21514; Mixed: SMT; Extra: BF 1608 (0603); Tolerance: 1%; Case: 1608 (0603); Technology: TK100
R5 = 21378: WID SMD 8K06 1% 0,1W BF 1608 (0603); Value: 8.06K; Mixed: SMT; Preferred: Yes; Tolerance: 1%; Case: 1608 (0603); Technology: TK100
R6 = 21514: WID SMD 1K5 1% 0,1W; AN: 21514; Mixed: SMT; Value: 1.5K; Extra: BF 1608 (0603); Tolerance: 1%; Case: 1608 (0603); Technology: TK100
TP1 TP2 = 25063: AN: 25063; Mixed: SMT
U1 U2 = 26051: AN: 26051; Mixed: SMT; Extra: 6-36V 5A MagI³C Power Module; Voltage: Adj.; Temperature-Range: -40/+125 (Tj); HelpURL: B:\AD\adlib\datasheet\171050601; Case: TO263-7EP; H-ART: 171050601; Storage-Temperature: -65/+150 (Abs)
X9 = Banannenstecker-Buchse Stäubli Rot: MULTI-CONTACT   23.3200-22   BANANA SOCKET, 24A, 4MM, THT, R/A, RED; Voltage Rating: 1kV; Gender: Female; Part Number: 23.3200-22; Manufacturer: Stäubli; PnP Value: 23.3200-22; Value: 23.3200-22; Supplier 1: Farnell; Manufacturer Part Number: 23.3200-22; RoHS: Yes; Category: Uncategorized; Stock 1: 1111; Pricing 1: 1=10,51000, 5=8,01000, 10=7,81000, 25=6,92000, 50=6,48000, 75=6,35000 (EUR); Color: Red; Contact Material: Brass,Gold; Contact Plating: Gold; Insulation Material: PVC; Min Operating Temperature: -40°C; Max Operating Temperature: 80°C; Current Rating: 24A; Connector Type: Socket; Termination: Through Hole; Voltage Rating (DC): 1kV; Voltage Rating (AC): 1kV; Length: 33mm; REACH SVHC: No SVHC; ComponentLink1URL: https://datasheet.ciiva.com/1123/308583-1123144.pdf?src-supplier=Newark; ComponentLink1Description: https://datasheet.ciiva.com/1123/308583-1123144.pdf?src-supplier=Newark; ComponentLink2URL: https://datasheet.ciiva.com/16979/0900766b8025b994-16979960.pdf?src-supplier=Allied+Electronics; ComponentLink2Description: https://datasheet.ciiva.com/16979/0900766b8025b994-16979960.pdf?src-supplier=Allied+Electronics; ComponentLink3URL: https://datasheet.ciiva.com/29247/731096-da-01-ml-4-mm-einbaub-slb4i-90-rot-de-en-fr-29247831.pdf?src-supplier=Conrad; ComponentLink3Description: https://datasheet.ciiva.com/29247/731096-da-01-ml-4-mm-einbaub-slb4i-90-rot-de-en-fr-29247831.pdf?src-supplier=Conrad; PnP Package: BANANA SOCKET; Supplier Part Number 1: 4130261
X10 X13-X15 = TSW-103-XX-XXX-S: as X3 on sheet Breakout_Connector; Created: 2020_11_26_AGeiger
X11 = IPL1-103-XX-X-D-X: 2.54mm Double Row Terminal Assembly; MF: SAMTEC; Created: 2018_05_02_AGeiger; Value: =MPN; MPN: IPL1-103-01-L-D-RA-K
X12 = Banannenstecker-Buchse Stäubli Schwarz: MULTI-CONTACT   23.3200-21   BANANA SOCKET, 24A, 4MM, THT, R/A, Black; Voltage Rating: 1kV; Gender: Female; Part Number: 23.3200-21; Manufacturer: Stäubli; PnP Value: 23.3200-21; Value: 23.3200-21; Manufacturer Part Number: 23.3200-21; RoHS: Yes; Category: Uncategorized; Color: Black; Contact Material: Brass,Gold; Contact Plating: Gold; Insulation Material: PVC; Min Operating Temperature: -40°C; Max Operating Temperature: 80°C; Current Rating: 24A; Connector Type: Socket; Termination: Through Hole; Voltage Rating (DC): 1kV; Voltage Rating (AC): 1kV; Length: 33mm; REACH SVHC: No SVHC; ComponentLink1URL: https://datasheet.ciiva.com/1123/308583-1123144.pdf?src-supplier=Newark; ComponentLink1Description: https://datasheet.ciiva.com/1123/308583-1123144.pdf?src-supplier=Newark; ComponentLink2URL: https://datasheet.ciiva.com/16979/0900766b8025b994-16979960.pdf?src-supplier=Allied+Electronics; ComponentLink2Description: https://datasheet.ciiva.com/16979/0900766b8025b994-16979960.pdf?src-supplier=Allied+Electronics; ComponentLink3URL: https://datasheet.ciiva.com/29247/731096-da-01-ml-4-mm-einbaub-slb4i-90-rot-de-en-fr-29247831.pdf?src-supplier=Conrad; ComponentLink3Description: https://datasheet.ciiva.com/29247/731096-da-01-ml-4-mm-einbaub-slb4i-90-rot-de-en-fr-29247831.pdf?src-supplier=Conrad; PnP Package: BANANA SOCKET; Supplier 1: Farnell; Supplier Part Number 1: 1085521

## Sheet UZ_D_Breakout_Board_Block_Diagram.SchDoc
size A4; PageSetup: Record=PageOptions|CenterHorizontal=True|CenterVertical=True|PrintScale=0.92|XCorrection=1.00|YCorrection=1.00|PrintKind=0|BorderSize=5000000|LeftOffset=0|BottomOffset=0|Orientation=2|PaperLength=1000|PaperWidth=1000|Scale=100|PaperSource=7|PrintQuality=-4|MediaType=1|DitherType=10|PrintScaleMode=1|PaperKind=A4; Author: Andreas Geiger; CompanyName: Technische Hochschule Nürnberg Georg Simon Ohm; Organization: UltraZohm; Address1: Kesslerplatz 12; Address2: 90489 Nürnberg; Address3: GERMANY; DocumentNumber: 1; SheetNumber: 1; SheetTotal: 5; Website: www.ultrazohm.com
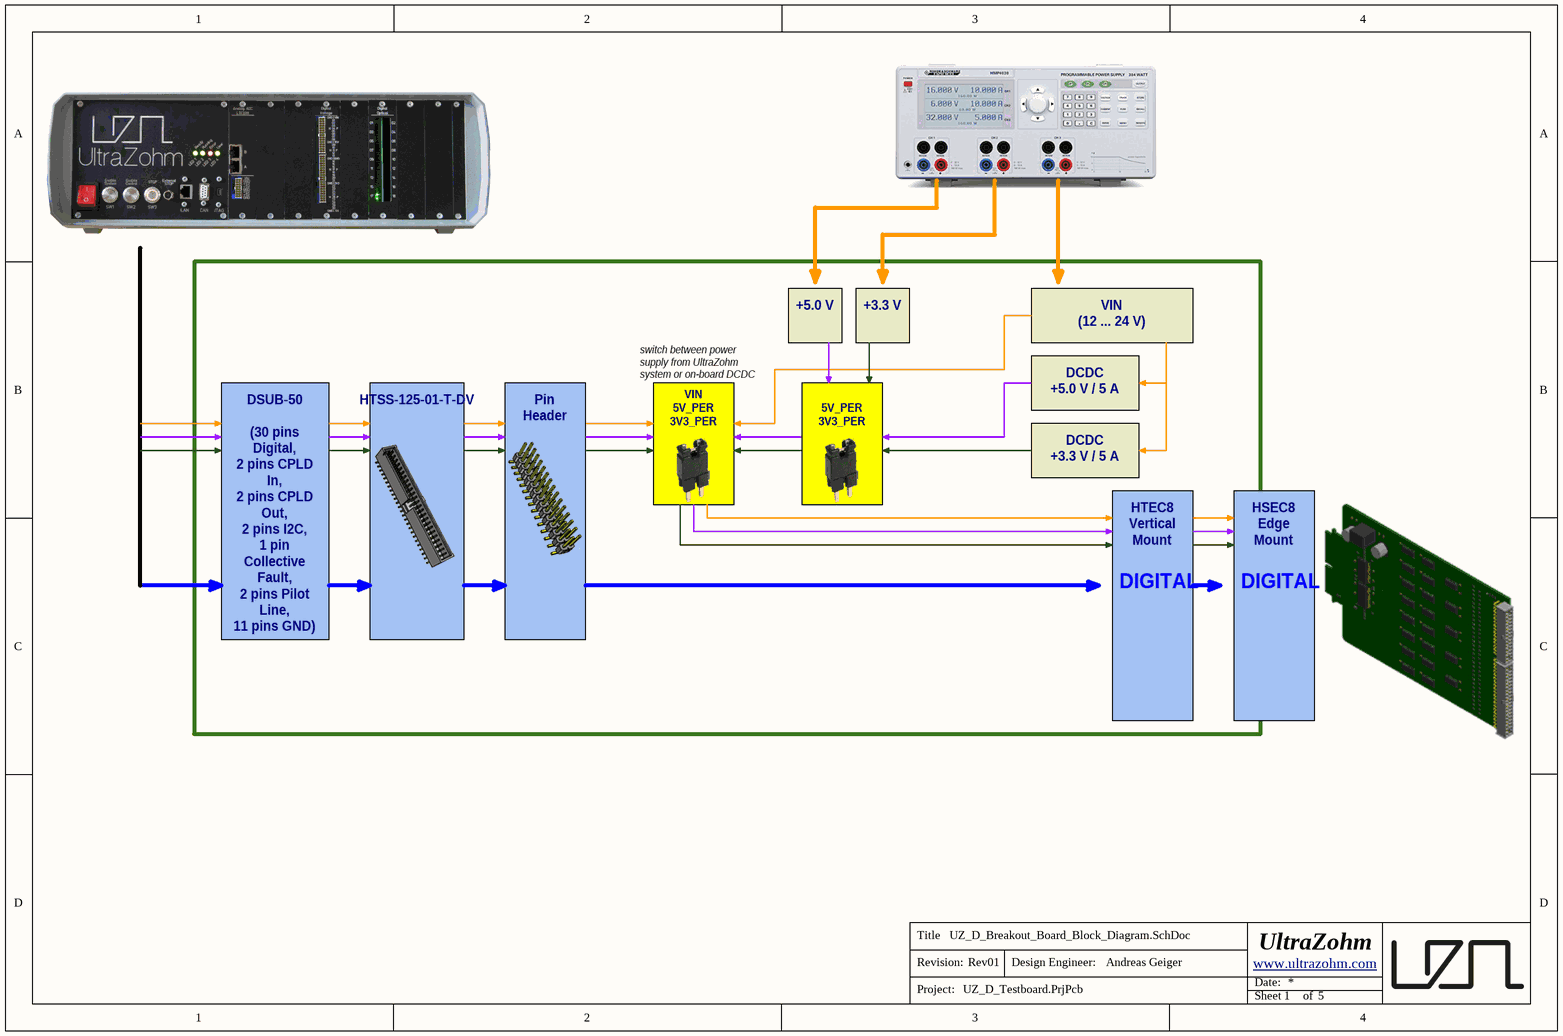
[diagram p4: UZ_D_Breakout_Board_Block_Diagram.SchDoc]

### Notes on the sheet
- switch between power supply from UltraZohm system or on-board DCDC
- +5.0 V
- +3.3 V
- VIN
  (12 ... 24 V)
- DCDC
  +5.0 V / 5 A
- VIN
  5V_PER
  3V3_PER
- 5V_PER
  3V3_PER
- DCDC
  +3.3 V / 5 A
- DSUB-50
  (30 pins Digital,
  2 pins CPLD In,
  2 pins CPLD Out,
  2 pins I2C,
  1 pin Collective Fault,
  2 pins Pilot Line,
  11 pins GND)
- HTSS-125-01-T-DV
- Pin Header
- DIGITAL
- HTEC8
  Vertical Mount
- HSEC8
  Edge Mount
- Title
- Revision:
- Design Engineer:
- Date:
- Project:
- Sheet
- of

## Nets that join several sheets
3V3_PER: Adapter_Card_Connector (X1.13 X1.14 X2.13 X2.14), Breakout_Connector (X5.2)
3V3_PER_ONBOARD: Breakout_Connector (X5.3), Power_Supply (X13.2)
5V_PER: Adapter_Card_Connector (X1.9 X1.10 X2.09 X2.10), Breakout_Connector (X4.2)
5V_PER_ONBOARD: Breakout_Connector (X4.3), Power_Supply (X10.2)
GND: Adapter_Card_Connector (92 pins), Breakout_Connector (40 pins), Power_Supply (36 pins)
VIN: Adapter_Card_Connector (X1.5 X1.6 X2.05 X2.06), Breakout_Connector (X3.2)
VIN_EXT: Breakout_Connector (X3.3), Power_Supply (L1.2 L2.2 X9.1 X11.4)
Collective_FLT: Adapter_Card_Connector (X1.96 X2.96), Breakout_Connector (X6.33 X7.58 X8.58)
CPLD_DigIn_01: Adapter_Card_Connector (X1.83 X2.83), Breakout_Connector (X6.14 X7.51 X8.51)
CPLD_DigIn_02: Adapter_Card_Connector (X1.85 X2.85), Breakout_Connector (X6.31 X7.53 X8.53)
CPLD_DigOut_01: Adapter_Card_Connector (X1.84 X2.84), Breakout_Connector (X6.48 X7.52 X8.52)
CPLD_DigOut_02: Adapter_Card_Connector (X1.86 X2.86), Breakout_Connector (X6.15 X7.54 X8.54)
DIG_IO_00: Adapter_Card_Connector (X1.17 X2.17), Breakout_Connector (X6.36 X7.13 X8.13)
DIG_IO_01: Adapter_Card_Connector (X1.18 X2.18), Breakout_Connector (X6.3 X7.14 X8.14)
DIG_IO_02: Adapter_Card_Connector (X1.21 X2.21), Breakout_Connector (X6.20 X7.15 X8.15)
DIG_IO_03: Adapter_Card_Connector (X1.22 X2.22), Breakout_Connector (X6.37 X7.16 X8.16)
DIG_IO_04: Adapter_Card_Connector (X1.25 X2.25), Breakout_Connector (X6.4 X7.17 X8.17)
DIG_IO_05: Adapter_Card_Connector (X1.26 X2.26), Breakout_Connector (X6.21 X7.18 X8.18)
DIG_IO_06: Adapter_Card_Connector (X1.29 X2.29), Breakout_Connector (X6.38 X7.21 X8.21)
DIG_IO_07: Adapter_Card_Connector (X1.30 X2.30), Breakout_Connector (X6.22 X7.22 X8.22)
DIG_IO_08: Adapter_Card_Connector (X1.33 X2.33), Breakout_Connector (X6.39 X7.23 X8.23)
DIG_IO_09: Adapter_Card_Connector (X1.34 X2.34), Breakout_Connector (X6.6 X7.24 X8.24)
DIG_IO_10: Adapter_Card_Connector (X1.37 X2.37), Breakout_Connector (X6.23 X7.25 X8.25)
DIG_IO_11: Adapter_Card_Connector (X1.38 X2.38), Breakout_Connector (X6.40 X7.26 X8.26)
DIG_IO_12: Adapter_Card_Connector (X1.41 X2.41), Breakout_Connector (X6.7 X7.29 X8.29)
DIG_IO_13: Adapter_Card_Connector (X1.42 X2.42), Breakout_Connector (X6.41 X7.30 X8.30)
DIG_IO_14: Adapter_Card_Connector (X1.45 X2.45), Breakout_Connector (X6.8 X7.31 X8.31)
DIG_IO_15: Adapter_Card_Connector (X1.46 X2.46), Breakout_Connector (X6.25 X7.32 X8.32)
DIG_IO_16: Adapter_Card_Connector (X1.49 X2.49), Breakout_Connector (X6.42 X7.33 X8.33)
DIG_IO_17: Adapter_Card_Connector (X1.50 X2.50), Breakout_Connector (X6.9 X7.34 X8.34)
DIG_IO_18: Adapter_Card_Connector (X1.53 X2.53), Breakout_Connector (X6.26 X7.37 X8.37)
DIG_IO_19: Adapter_Card_Connector (X1.54 X2.54), Breakout_Connector (X6.10 X7.38 X8.38)
DIG_IO_20: Adapter_Card_Connector (X1.57 X2.57), Breakout_Connector (X6.27 X7.39 X8.39)
DIG_IO_21: Adapter_Card_Connector (X1.58 X2.58), Breakout_Connector (X6.44 X7.40 X8.40)
DIG_IO_22: Adapter_Card_Connector (X1.61 X2.61), Breakout_Connector (X6.11 X7.41 X8.41)
DIG_IO_23: Adapter_Card_Connector (X1.62 X2.62), Breakout_Connector (X6.28 X7.42 X8.42)
DIG_IO_24: Adapter_Card_Connector (X1.65 X2.65), Breakout_Connector (X6.45 X7.45 X8.45)
DIG_IO_25: Adapter_Card_Connector (X1.66 X2.66), Breakout_Connector (X6.29 X7.46 X8.46)
DIG_IO_26: Adapter_Card_Connector (X1.69 X2.69), Breakout_Connector (X6.46 X7.47 X8.47)
DIG_IO_27: Adapter_Card_Connector (X1.70 X2.70), Breakout_Connector (X6.13 X7.48 X8.48)
DIG_IO_28: Adapter_Card_Connector (X1.73 X2.73), Breakout_Connector (X6.30 X7.49 X8.49)
DIG_IO_29: Adapter_Card_Connector (X1.74 X2.74), Breakout_Connector (X6.47 X7.50 X8.50)
PILOT_IN: Adapter_Card_Connector (X1.100 X2.100), Breakout_Connector (X6.17 X7.60 X8.60)
PILOT_OUT: Adapter_Card_Connector (X1.99 X2.99), Breakout_Connector (X6.50 X7.59 X8.59)
PS_I2C0_shared_SCL: Adapter_Card_Connector (X1.89 X2.89), Breakout_Connector (X6.49 X7.55 X8.55)
PS_I2C0_shared_SDA: Adapter_Card_Connector (X1.90 X2.90), Breakout_Connector (X6.16 X7.56 X8.56)